# Altium schematic sheet МИЭМ.467999.001Э3.SchDoc
size 420 x 297 mm; Author: Бадлян Р. К.; CompanyName: МИЭМ; Organization: МИЭМ; SheetNumber: 1; SheetTotal: 4; Name: Плата отладочная; DecimalNumber: МИЭМ.467999.001Э3; MainDevice: МИЭМ.467999.001; Job_Title: Вед. Инж.
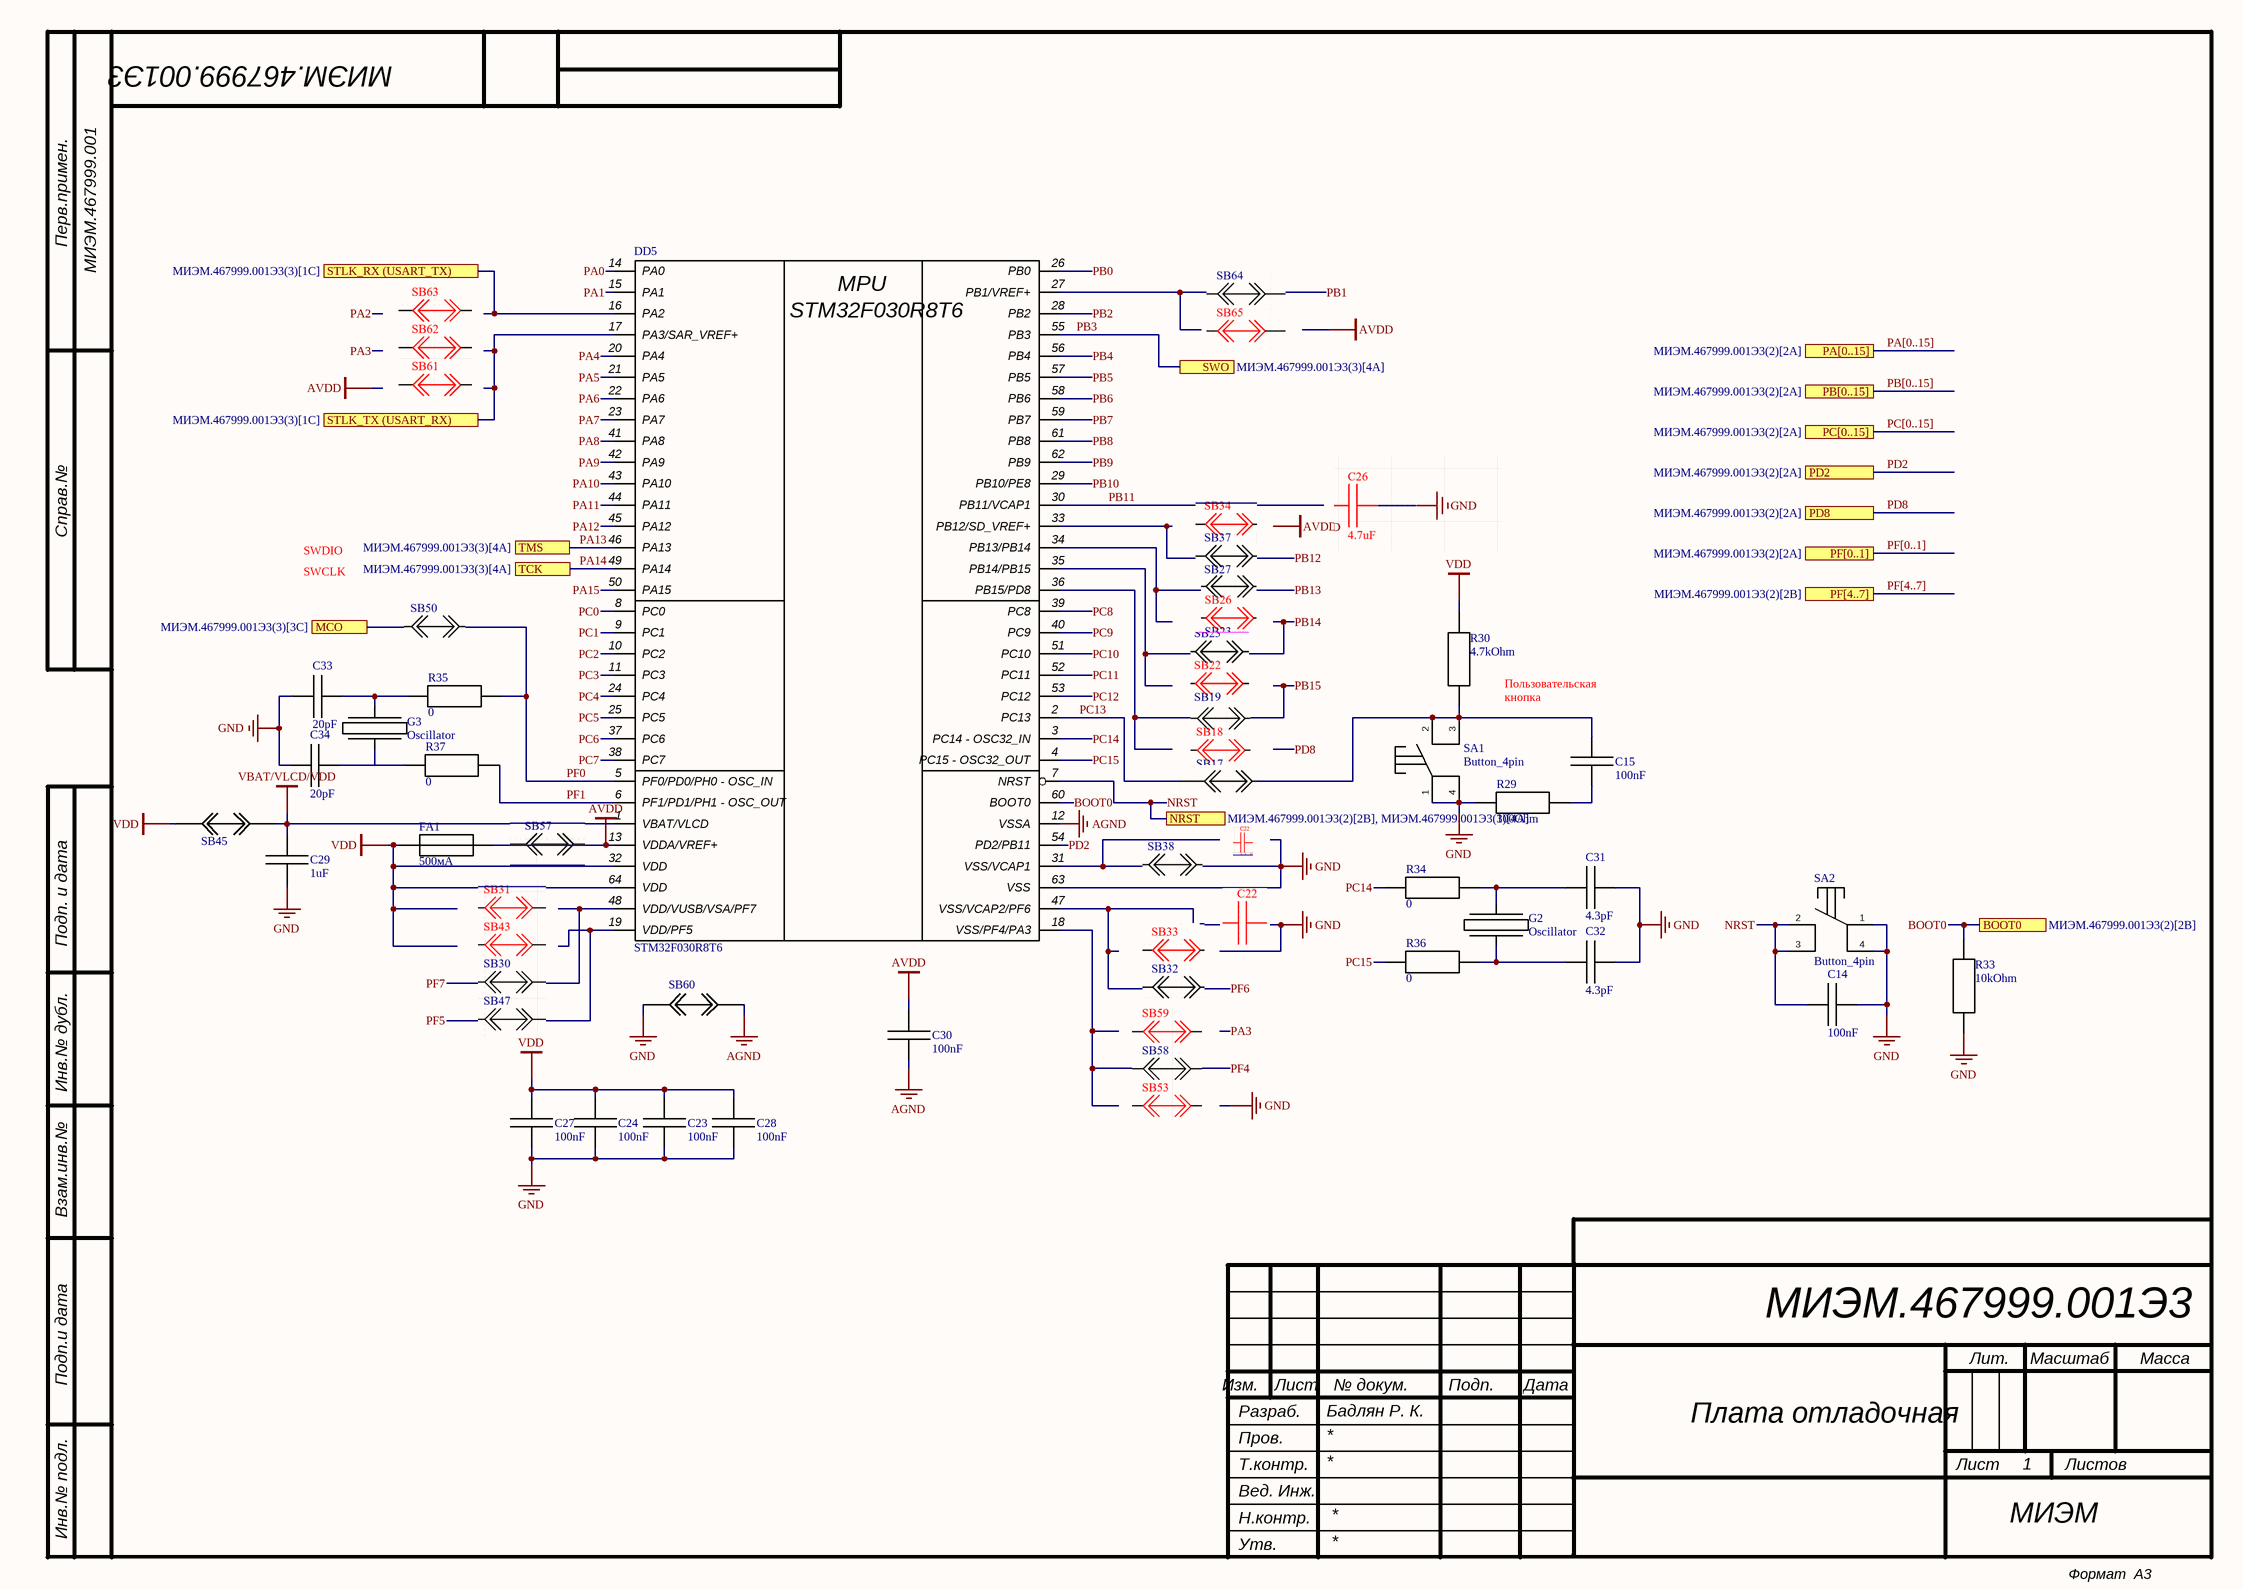
[diagram p0: МИЭМ.467999.001Э3.SchDoc]

## Parts
C14  100nF  [0603]
C15  100nF  [0603]
C23  100nF  [0603]
C24  100nF  [0603]
C27  100nF  [0603]
C28  100nF  [0603]
C29  1uF  [0603]
C30  100nF  [0603]
C31  4.3pF  [0603]
C32  4.3pF  [0603]
C33  20pF  [0603]
C34  20pF  [0603]
DD5  STM32F030R8T6  [LQFP64-10x10mm]
FA1  500мА  [FCM1608KF-601T05]
G2  Oscillator  [ABS25-32.768KHZ-6-T]
G3  Oscillator  [HC49SMD]
R29  100Ohm  [0603]
R30  4.7kOhm  [0603]
R33  10kOhm  [0603]
R34  0  [0603]
R35  0  [0603]
R36  0  [0603]
R37  0  [0603]
SA1  Button_4pin  [Button_4pin]
SA2  Button_4pin  [Button_4pin]
SB45  Jumper  [Jumper]  (value not drawn)
SB60  Jumper  [Jumper]  (value not drawn)

## Ports
BOOT0 (see МИЭМ.467999.001Э3(2)[2B]), MCO (see МИЭМ.467999.001Э3(3)[3C]), NRST (see МИЭМ.467999.001Э3(2)[2B], МИЭМ.467999.001Э3(3)[4A]), PA[0..15] (see МИЭМ.467999.001Э3(2)[2A]), PB[0..15] (see МИЭМ.467999.001Э3(2)[2A]), PC[0..15] (see МИЭМ.467999.001Э3(2)[2A]), PD2 (see МИЭМ.467999.001Э3(2)[2A]), PD8 (see МИЭМ.467999.001Э3(2)[2A]), PF[0..1] (see МИЭМ.467999.001Э3(2)[2A]), PF[4..7] (see МИЭМ.467999.001Э3(2)[2B]), STLK_RX (USART_TX) (see МИЭМ.467999.001Э3(3)[1C]), STLK_TX (USART_RX) (see МИЭМ.467999.001Э3(3)[1C]), SWO (see МИЭМ.467999.001Э3(3)[4A]), TCK (see МИЭМ.467999.001Э3(3)[4A]), TMS (see МИЭМ.467999.001Э3(3)[4A])

## Nets
AGND: C30.1 DD5.12(VSSA) SB60.2
AVDD: C30.2 DD5.13(VDDA/VREF+) FA1.1
GND: C14.1 C23.1 C24.1 C27.1 C28.1 C29.1 C31.1 C32.1 C33.2 C34.2 DD5.31(VSS/VCAP1) DD5.63(VSS) R29.1 R33.1 SA1.1 SA1.4 SA2.1 SA2.4 SB60.1
VBAT/VLCD/VDD: C29.2 DD5.1(VBAT/VLCD) SB45.2
VDD: C23.2 C24.2 C27.2 C28.2 DD5.32(VDD) DD5.64(VDD) FA1.2 R30.2 SB45.1
BOOT0: DD5.60(BOOT0) R33.2 ; port BOOT0
NRST: C14.2 DD5.7(NRST) SA2.2 SA2.3 ; port NRST
PA0: DD5.14(PA0)
PA1: DD5.15(PA1)
PA4: DD5.20(PA4)
PA5: DD5.21(PA5)
PA6: DD5.22(PA6)
PA7: DD5.23(PA7)
PA8: DD5.41(PA8)
PA9: DD5.42(PA9)
PA10: DD5.43(PA10)
PA11: DD5.44(PA11)
PA12: DD5.45(PA12)
PA13: DD5.46(PA13) ; port TMS
PA14: DD5.49(PA14) ; port TCK
PA15: DD5.50(PA15)
PB0: DD5.26(PB0)
PB1: DD5.27(PB1/VREF+)
PB2: DD5.28(PB2)
PB3: DD5.55(PB3) ; port SWO
PB4: DD5.56(PB4)
PB5: DD5.57(PB5)
PB6: DD5.58(PB6)
PB7: DD5.59(PB7)
PB8: DD5.61(PB8)
PB9: DD5.62(PB9)
PB10: DD5.29(PB10/PE8)
PB11: DD5.30(PB11/VCAP1)
PB12: DD5.33(PB12/SD_VREF+)
PB13: DD5.34(PB13/PB14)
PB14: DD5.35(PB14/PB15)
PB15: DD5.36(PB15/PD8)
PC0: DD5.8(PC0)
PC1: DD5.9(PC1)
PC2: DD5.10(PC2)
PC3: DD5.11(PC3)
PC4: DD5.24(PC4)
PC5: DD5.25(PC5)
PC6: DD5.37(PC6)
PC7: DD5.38(PC7)
PC8: DD5.39(PC8)
PC9: DD5.40(PC9)
PC10: DD5.51(PC10)
PC11: DD5.52(PC11)
PC12: DD5.53(PC12)
PC13: C15.2 DD5.2(PC13) R30.1 SA1.2 SA1.3
PC14: DD5.3(PC14_-_OSC32_IN) R34.1
PC15: DD5.4(PC15_-_OSC32_OUT) R36.1
PD2: DD5.54(PD2/PB11) ; port PD2
PD8: port PD8
PF0: DD5.5(PF0/PD0/PH0_-_OSC_IN) R35.2 ; port MCO
PF1: DD5.6(PF1/PD1/PH1_-_OSC_OUT) R37.2
PF4: DD5.18(VSS/PF4/PA3)
PF5: DD5.19(VDD/PF5)
PF6: DD5.47(VSS/VCAP2/PF6)
PF7: DD5.48(VDD/VUSB/VSA/PF7)
STLK_RX (USART_TX): DD5.16(PA2) ; port STLK_RX (USART_TX)
STLK_TX (USART_RX): DD5.17(PA3/SAR_VREF+) ; port STLK_TX (USART_RX)
NetC15_1: C15.1 R29.2
NetC31_2: C31.2 G2.1 R34.2
NetC32_2: C32.2 G2.2 R36.2
NetC33_1: C33.1 G3.1 R35.1
NetC34_1: C34.1 G3.2 R37.1

## Buses and harness runs
bus PA[0..15] = port PA[0..15]
bus PB[0..15] = port PB[0..15]
bus PC[0..15] = port PC[0..15]
bus PF[0..1] = port PF[0..1]
bus PF[4..7] = port PF[4..7]

## Notes on the sheet
- SWCLK
- SWDIO
- Пользовательская кнопка
- Labels drawn without touching a wire or pin: AVDD
- Перв.примен.
- Справ.№
- Подп. и дата
- Инв.№ дубл.
- Взам.инв.№
- Подп.и дата
- Разраб.
- Изм.
- Лист
- № докум.
- Подп.
- Дата
- Лит.
- Масштаб
- Масса
- Т.контр.
- Пров.
- Листов
- Инв.№ подл.
- Утв.
- Н.контр.
- Формат  A3
- (in symbol STM32F030R8T6) MPU

## Library data of the parts
C14 C15 C23 C24 C27 C28 C30 = Сapacitor: PartNumber: CC0603KRX7R0BB104; Manufacturer: Yageo; VCC: 100В; Tolerance: 10%; Ta: 125°C; Value: 100nF; Package: 0603; ComponentLink1Description: Datasheet; ComponentLink1URL: *; ComponentLink2Description: Source; ComponentLink2URL: https://www.chipdip.ru/product/0.1mkf-x7r-100v-10-0603-cc0603krx7r0bb104-kondensator-yageo-9000578715
C29 = Сapacitor: PartNumber: GRM185R61A105K; Manufacturer: Murata Electronics; VCC: 10В; Tolerance: 10%; Ta: 85°C; Value: 1uF; Package: 0603; ComponentLink1Description: Datasheet; ComponentLink1URL: *; ComponentLink2Description: Source; ComponentLink2URL: https://www.chipdip.ru/product/1mkf-x5r-10v-10-0603-grm185r61a105k-kondensator-murata-767906735
C31 C32 = Сapacitor: PartNumber: CC0603CRNPO9BN4R3; Manufacturer: Yageo; VCC: 50В; Tolerance: 1%; Ta: 125°C; Value: 4.3pF; Package: 0603; ComponentLink1Description: Datasheet; ComponentLink1URL: *; ComponentLink2Description: Source; ComponentLink2URL: https://www.chipdip.ru/product/4.3pf-np0-50v-0.25pf-0603-cc0603crnpo9bn4r3-yageo-9000952764
C33 C34 = Сapacitor: PartNumber: GRM1885C1H200J; Manufacturer: Murata Electronics; VCC: 50В; Tolerance: 5%; Ta: 155°C; Value: 20pF; Package: 0603; ComponentLink1Description: Datasheet; ComponentLink1URL: *; ComponentLink2Description: Source; ComponentLink2URL: https://www.chipdip.ru/product/20pf-np0-50v-5-0603-grm1885c1h200j-kondensator-murata-268501846
DD5 = STM32F030R8T6: Manufacturer: STMicroelectronics; Frequency: 48МГц; Ta: 85°C; Desc: Микроконтроллер ARM; ComponentLink1Description: Source; ComponentLink1URL: https://www.chipdip.ru/product/stm32f030r8t6-mikrokontroller-arm-st-microelectronics-9000247632; Package: LQFP64-10x10; PartNumber: STM32F030R8T6; ComponentLink2Description: Datasheet; ComponentLink2URL: https://static.chipdip.ru/lib/915/DOC012915875.pdf; ClassName: STM
FA1 = Fuse: Desc: Сердечник ферритовый; Current: 500мА; Package: 0603; PartNumber: FCM1608KF-601T05; ComponentLink1Description: Datasheet; ComponentLink1URL: *; ComponentLink2Description: Source; ComponentLink2URL: https://www.chipdip.ru/product/fcm1608kf-601t05-tai-tech-8040727428
G2 = Oscillator: Desc: Осциллятор кварцевый; Frequence: 32.768КГц; Ta: 85°C; Tolerance: 0.002%; PartNumber: ABS25-32.768KHZ-6-T; ComponentLink1Description: Source; ComponentLink1URL: https://www.chipdip.ru/product/abs25-32.768khz-6-t-abracon-8001972524; ComponentLink2Description: Datasheet; ComponentLink2URL: *; Package: QSMD8x3.8
G3 = Oscillator: Desc: Осциллятор кварцевый; Frequence: 8МГц; Ta: 70°С; PartNumber: *; ComponentLink1Description: Source; ComponentLink1URL: https://www.chipdip.ru/product/hc49smd-8-mhz-20pf-30ppm-ruichi-8022445237; ComponentLink2Description: Datasheet; ComponentLink2URL: *; Tolerance: *; Package: HC49SMD
R29 = Resistor: PartNumber: AC0603FR-07100RL; Manufacturer: Yageo; VCC: 75В; Power: 0.1Вт; Ta: 155°C; Tolerance: 1%; Value: 100Ohm; Package: 0603; ComponentLink1Description: Datasheet; ComponentLink1URL: *; ComponentLink2Description: Source; ComponentLink2URL: https://www.chipdip.ru/product/0.1vt-0603-100-om-1-ac0603fr-07100rl-chip-rezistor-yageo-9000495858
R30 = Resistor: PartNumber: RC0603JR-074K7L; Manufacturer: Yageo; VCC: 75В; Power: 0.1Вт; Ta: 155°C; Tolerance: 5%; Value: 4.7kOhm; Package: 0603; ComponentLink1Description: Datasheet; ComponentLink1URL: *; ComponentLink2Description: Source; ComponentLink2URL: https://www.chipdip.ru/product/0.1vt-0603-4.7-kom-5-rc0603jr-074k7l-chip-rezistor-yageo-9000301240
R33 = Resistor: PartNumber: RC0603FR-0710KL; VCC: 50В; Power: 0.1Вт; Ta: 155°C; Tolerance: 1%; Value: 10kOhm; Package: 0603; Manufacturer: *; ComponentLink1Description: Datasheet; ComponentLink1URL: *; ComponentLink2Description: Source; ComponentLink2URL: https://www.chipdip.ru/product/0.1vt-0603-10-kom-1-chip-rezistor-smd-9000079736
R34-R37 = Resistor: PartNumber: RC0603FR-070RL; Manufacturer: Yageo; VCC: 75В; Power: 0.1Вт; Ta: 155°C; Tolerance: 1%; Value: 0; Package: 0603; ComponentLink1Description: Datasheet; ComponentLink1URL: *; ComponentLink2Description: Source; ComponentLink2URL: https://www.chipdip.ru/product/0.1vt-0603-0-om-1-rc0603fr-070rl-chip-rezistor-smd-yageo-9001227234
SA1 SA2 = Button_4pin: PartNumber: KAN0641-0431B; Desc: Выключатель кнопочный нажимной; ComponentLink1Description: Source; ComponentLink1URL: https://www.chipdip.ru/product/taktovaya-knopka-6.0x-4.3-algoritm-raboty-no-td-06xg-9000914059
SB45 SB60 = Jumper: Desc: Перемычка; State: Установлен